# EAGLE schematic prot_PBC (EAGLE 6.0)
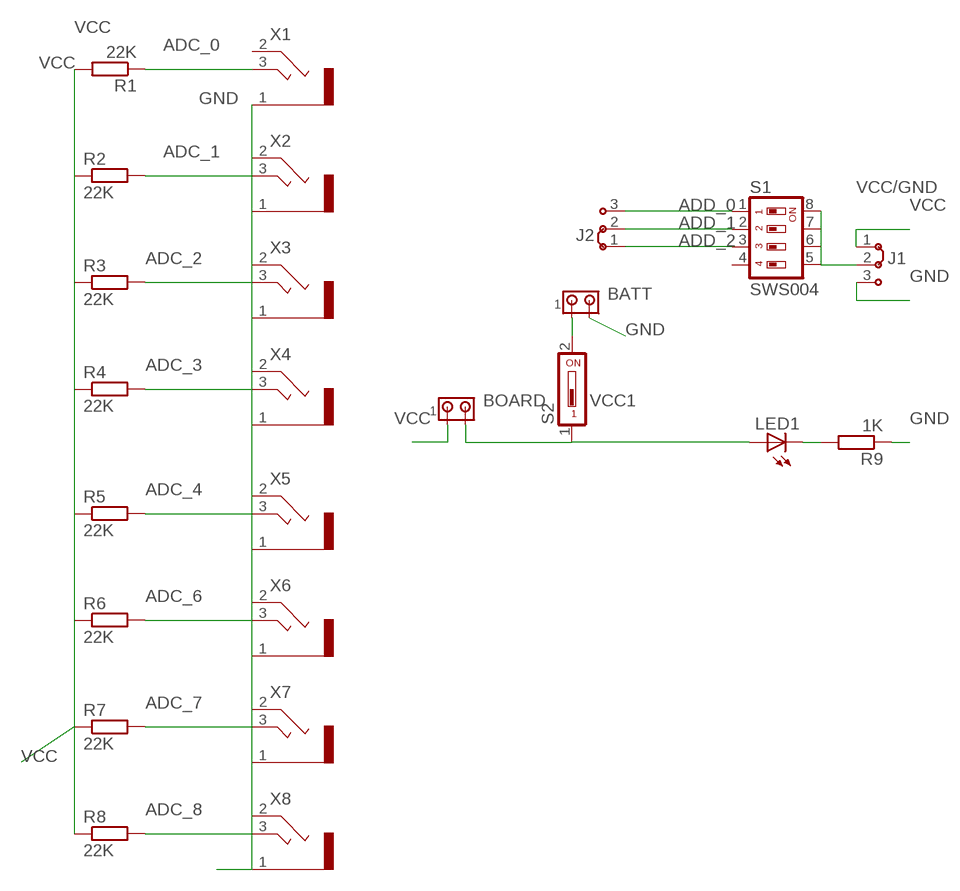
[diagram p0: schematic, sheet 1]

## Parts
BATT  MTA02-156  [1X2MTA]
BOARD  MTA02-156  [1X2MTA]
J1  J2X2MM  [04C]
J2  J2X2MM  [04C]
LED1  LED5MM  [LED5MM]
R1  22K  R-EU_0207/7  [0207/7]
R2  22K  R-EU_0207/7  [0207/7]
R3  22K  R-EU_0207/7  [0207/7]
R4  22K  R-EU_0207/7  [0207/7]
R5  22K  R-EU_0207/7  [0207/7]
R6  22K  R-EU_0207/7  [0207/7]
R7  22K  R-EU_0207/7  [0207/7]
R8  22K  R-EU_0207/7  [0207/7]
R9  1K  R-EU_0207/7  [0207/7]
S1  SWS004  [SMS-004]
S2  DS01  [DS-01]
X1  1501_03  [1501_03]
X2  1501_03  [1501_03]
X3  1501_03  [1501_03]
X4  1501_03  [1501_03]
X5  1501_03  [1501_03]
X6  1501_03  [1501_03]
X7  1501_03  [1501_03]
X8  1501_03  [1501_03]

## Nets
ADC_0: R1.1 X1.3
ADC_1: R2.2 X2.3
ADC_2: R3.2 X3.3
ADC_3: R4.2 X4.3
ADC_4: R5.2 X5.3
ADC_6: R6.2 X6.3
ADC_7: R7.2 X7.3
ADC_8: R8.2 X8.3
ADD_0: J2.3 S1.1
ADD_1: J2.2 S1.2
ADD_2: J2.1 S1.3
GND: BATT.2 J1.3 R9.1 X1.1 X2.1 X3.1 X4.1 X5.1 X6.1 X7.1 X8.1
N$1: LED1.K(C) R9.2
N$2: BATT.1 S2.2
VCC: BOARD.1 J1.1 R1.2 R2.1 R3.1 R4.1 R5.1 R6.1 R7.1 R8.1
VCC1: BOARD.2 LED1.A S2.1
VCC/GND: J1.2 S1.5 S1.6 S1.7 S1.8
Unconnected: S1.4 X1.2 X2.2 X3.2 X4.2 X5.2 X6.2 X7.2 X8.2

## Library data of the parts
BATT BOARD = con-amp:MTA02-156: AMP connector
J1 J2 = jumper:J2: Jumper switch 2 x 2.5 mm
LED1 = led:LED: LED OSRAM: - CHIPLED LG R971, LG N971, LY N971, LG Q971, LY Q971, LO R971, LY R971 LH N974, LH R974 LS Q976, LO Q976, LY Q976 LO Q996 - Hyper CHIPLED LW Q18S LB Q993, LB Q99A, LB R99A - SideLED LS A670, LO A670, LY A670, LG A670, LP A670 LB A673, LV A673, LT A673, LW A673 LH A674 LY A675 LS A676, LA A676, LO A676, LY A676, LW A676 LS A679, LY A679, LG A679 - Hyper Micro SIDELED® LS Y876, LA Y876, LO Y876, LY Y876 LT Y87S - SmartLED LW L88C, LW L88S LB L89C, LB L89S, LG L890 LS L89K, LO L89K, LY L89K LS L896, LA L896, LO L896, LY L896 - TOPLED LS T670, LO T670, LY T670, LG T670, LP T670 LSG T670, LSP T670, LSY T670, LOP T670, LYG T670 LG T671, LOG T671, LSG T671 LB T673, LV T673, LT T673, LW T673 LH T674 LS T676, LA T676, LO T676, LY T676, LB T676, LH T676, LSB T676, LW T676 LB T67C, LV T67C, LT T67C, LS T67K, LO T67K, LY T67K, LW E67C LS E67B, LA E67B, LO E67B, LY E67B, LB E67C, LV E67C, LT E67C LW T67C LS T679, LY T679, LG T679 LS T770, LO T770, LY T770, LG T770, LP T770 LB T773, LV T773, LT T773, LW T773 LH T774 LS E675, LA E675, LY E675, LS T675 LS T776, LA T776, LO T776, LY T776, LB T776 LHGB T686 LT T68C, LB T68C - Hyper Mini TOPLED® LB M676 - Mini TOPLED Santana® LG M470 LS M47K, LO M47K, LY M47K Source: http://www.osram.convergy.de LUXEON: - LUMILED® LXK2-PW12-R00, LXK2-PW12-S00, LXK2-PW14-U00, LXK2-PW14-V00 LXK2-PM12-R00, LXK2-PM12-S00, LXK2-PM14-U00 LXK2-PE12-Q00, LXK2-PE12-R00, LXK2-PE12-S00, LXK2-PE14-T00, LXK2-PE14-U00 LXK2-PB12-K00, LXK2-PB12-L00, LXK2-PB12-M00, LXK2-PB14-N00, LXK2-PB14-P00, LXK2-PB14-Q00 LXK2-PR12-L00, LXK2-PR12-M00, LXK2-PR14-Q00, LXK2-PR14-R00 LXK2-PD12-Q00, LXK2-PD12-R00, LXK2-PD12-S00 LXK2-PH12-R00, LXK2-PH12-S00 LXK2-PL12-P00, LXK2-PL12-Q00, LXK2-PL12-R00 Source: www.luxeon.com KINGBRIGHT: KA-3528ASYC Source: www.kingbright.com
R1-R9 = resistor:R-EU_: RESISTOR, European symbol
S1 = smd-special:SWS004: SMD Dip Switch 4 pol.
S2 = switch-dil:DS01: DIL/CODE SWITCH; OC_FARNELL: unknown; OC_NEWARK: unknown
X1-X8 = con-lumberg:1501_03: Klinkensteckverbinder nach JISC 6560, 2,5 mm Jack connectors according to JISC 6560, 2.5 mm Source: http://www.lumberg.com/Produkte/PDFs/1501_03.pdf; OC_FARNELL: 1200127; OC_NEWARK: unknown